# EAGLE design RF Power Meter (EAGLE 7.7.0)
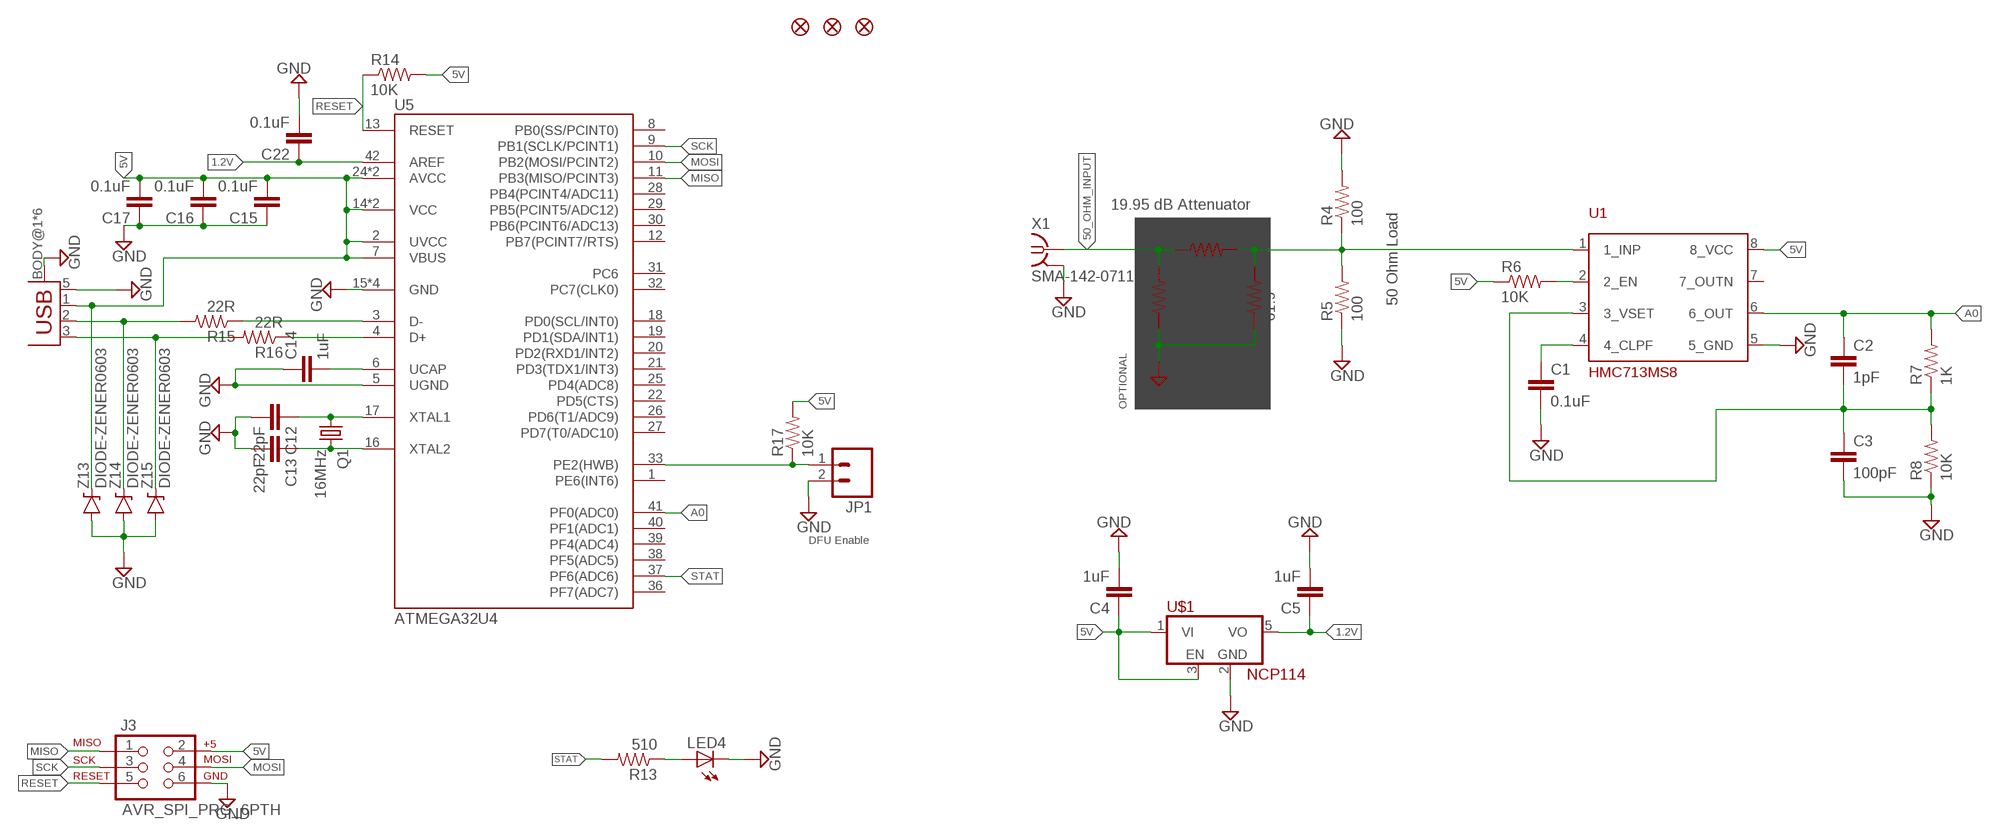
[diagram p0: schematic, sheet 1]

## Parts
C1  0.1uF  CAP0603-CAP  [0603-CAP]
C2  1pF  CAP0603-CAP  [0603-CAP]
C3  100pF  CAP0603-CAP  [0603-CAP]
C4  1uF  CAP0603-CAP  [0603-CAP]
C5  1uF  CAP0603-CAP  [0603-CAP]
C12  22pF  CAP0603-CAP  [0603-CAP]
C13  22pF  CAP0603-CAP  [0603-CAP]
C14  1uF  CAP0603-CAP  [0603-CAP]
C15  0.1uF  CAP0603-CAP  [0603-CAP]
C16  0.1uF  CAP0603-CAP  [0603-CAP]
C17  0.1uF  CAP0603-CAP  [0603-CAP]
C22  0.1uF  CAP0603-CAP  [0603-CAP]
J3  AVR_SPI_PRG_6PTH  [2X3]
JP1  M02PTH3  [1X02_LONGPADS]
JP2  FIDUCIAL1X2  [FIDUCIAL-1X2]
JP3  FIDUCIAL1X2  [FIDUCIAL-1X2]
JP4  FIDUCIAL1X2  [FIDUCIAL-1X2]
LED4  LED0603  [LED-0603]
Q1  16MHz  CRYSTAL3.2X2.5  [CRYSTAL_3.2X2.5]
R1  61.9  RESISTOR1206  [1206]
R2  249  RESISTOR1206  [1206]
R3  61.9  RESISTOR1206  [1206]
R4  100  RESISTOR1206  [1206]
R5  100  RESISTOR1206  [1206]
R6  10K  RESISTOR0603-RES  [0603-RES]
R7  1K  RESISTOR0603-RES  [0603-RES]
R8  10K  RESISTOR0603-RES  [0603-RES]
R13  510  RESISTOR0603-RES  [0603-RES]
R14  10K  RESISTOR0603-RES  [0603-RES]
R15  22R  RESISTOR0603-RES  [0603-RES]
R16  22R  RESISTOR0603-RES  [0603-RES]
R17  10K  RESISTOR0603-RES  [0603-RES]
U1  HMC713MS8  [MSOP-8]
U5  ATMEGA32U4  [TQFP-44]
U$1  NCP114  [SOT-23-5]
X1  SMA-142-0711-821/826  [J502-ND-142-0711-821/826]
X3  USB-MICROB  [USB-MICROB-10118192]
Z13  DIODE-ZENER0603  [0603-DIODE]
Z14  DIODE-ZENER0603  [0603-DIODE]
Z15  DIODE-ZENER0603  [0603-DIODE]

## Nets
1.2V: C5.1 C22.1 U5.42(AREF) U$1.5(VO)
5V: C4.1 C15.2 C16.2 C17.2 J3.2 R6.1 R14.2 R17.2 U1.8(8_VCC) U5.2(UVCC) U5.7(VBUS) U5.14(VCC) U5.24(AVCC) U5.34(VCC) U5.44(AVCC) U$1.1(VI) U$1.3(EN) X3.1(VBUS) Z13.C
50_OHM_INPUT: R1.2 R2.1 X1.1
A0: C2.1 R7.2 U1.6(6_OUT) U5.41(PF0(ADC0))
GND: C1.2 C3.2 C4.2 C5.2 C12.2 C13.2 C14.1 C15.1 C16.1 C17.1 C22.2 J3.6 JP1.2 LED4.C R1.1 R3.1 R4.2 R5.1 R8.1 U1.5(5_GND) U5.5(UGND) U5.15(GND) U5.23(GND) U5.35(GND) U5.43(GND) U$1.2(GND) X1.G@1 X1.G@2 X1.G@3 X1.G@4 X3.5(GND) X3.BODY@1(BODY) X3.BODY@2(BODY) X3.BODY@3(BODY) X3.BODY@4(BODY) X3.BODY@5(BODY) X3.BODY@6(BODY) Z13.A Z14.A Z15.A
MISO: J3.1 U5.11(PB3(MISO/PCINT3))
MOSI: J3.4 U5.10(PB2(MOSI/PCINT2))
N$4: R2.2 R3.2 R4.1 R5.2 U1.1(1_INP)
N$19: R6.2 U1.2(2_EN)
N$20: C1.1 U1.4(4_CLPF)
N$22: C2.2 C3.1 R7.1 R8.2 U1.3(3_VSET)
N$106: LED4.A R13.1
N$111: C12.1 Q1.P$1 U5.17(XTAL1)
N$113: C13.1 Q1.P$3 U5.16(XTAL2)
N$115: R15.2 X3.2(D-) Z14.C
N$116: C14.2 U5.6(UCAP)
N$117: R16.2 X3.3(D+) Z15.C
N$118: R16.1 U5.4(D+)
N$119: R15.1 U5.3(D-)
N$120: JP1.1 R17.1 U5.33(PE2(HWB))
RESET: J3.5 R14.1 U5.13(RESET)
SCK: J3.3 U5.9(PB1(SCLK/PCINT1))
STAT: R13.2 U5.37(PF6(ADC6))
Unconnected: U1.7(7_OUTN) U5.1(PE6(INT6)) U5.8(PB0(SS/PCINT0)) U5.12(PB7(PCINT7/RTS)) U5.18(PD0(SCL/INT0)) U5.19(PD1(SDA/INT1)) U5.20(PD2(RXD1/INT2)) U5.21(PD3(TDX1/INT3)) U5.22(PD5(CTS)) U5.25(PD4(ADC8)) U5.26(PD6(T1/ADC9)) U5.27(PD7(T0/ADC10)) U5.28(PB4(PCINT4/ADC11)) U5.29(PB5(PCINT5/ADC12)) U5.30(PB6(PCINT6/ADC13)) U5.31(PC6) U5.32(PC7(CLK0)) U5.36(PF7(ADC7)) U5.38(PF5(ADC5)) U5.39(PF4(ADC4)) U5.40(PF1(ADC1))

## Notes on the sheet
- 19.95 dB Attenuator
- 50 Ohm Load
- OPTIONAL
- DFU Enable

## Library data of the parts
C1-C5 C12-C17 C22 = SparkFun:CAP: Capacitor Standard 0603 ceramic capacitor, and 0.1" leaded capacitor.
J3 = SparkFun:AVR_SPI_PRG_6: AVR ISP 6 Pin This is the reduced ISP connector for AVR programming. Common on Arduino. This footprint will take up less PCB space and can be used with a 10-pin to 6-pin adapter such as SKU: BOB-08508
JP1 = SparkFun:M02: Header 2 Standard 2-pin 0.1" header. Use with straight break away headers (SKU : PRT-00116), right angle break away headers (PRT-00553), swiss pins (PRT-00743), machine pins (PRT-00117), and female headers (PRT-00115). Molex polarized connector foot print use with SKU : PRT-08233 with associated crimp pins and housings.
JP2-JP4 = SparkFun:FIDUCIAL: Fiducial Alignment Points Various fiducial points for machine vision alignment.
LED4 = SparkFun:LED: LEDs Standard schematic elements and footprints for 5mm, 3mm, 1206, and 0603 sized LEDs. 5mm - Spark Fun Electronics SKU : COM-00529 (and others)
Q1 = Nigel:CRYSTAL
R1-R8 R13-R17 = SparkFun:RESISTOR: Resistor Basic schematic elements and footprints for 0603, 1206, and PTH resistors.
U1 = Nigel:HMC713MS8: 54dB Logarithmic RF Detector 45 - 2700MHz
U5 = Nigel:ATMEGA32U4
U$1 = Nigel:NCP114: NCP114 300mA Low Dropout Linear Regulator
X1 = con-coax:SMA-: SMA 50 Ohm End Launch Jack Receptacle - Round Contact Johnson Components Source: www.johnsoncomponents.com .. J502-ND.pdf; MF: JOHNSON COMPONENTS; MPN: 142-0711-821; OC_FARNELL: 1019328; OC_NEWARK: 16F3627
X3 = Nigel:USB: USB Micro B Connector Ampehnol Part 10118192-0001LF
Z13-Z15 = Nigel:DIODE-ZENER

## Board
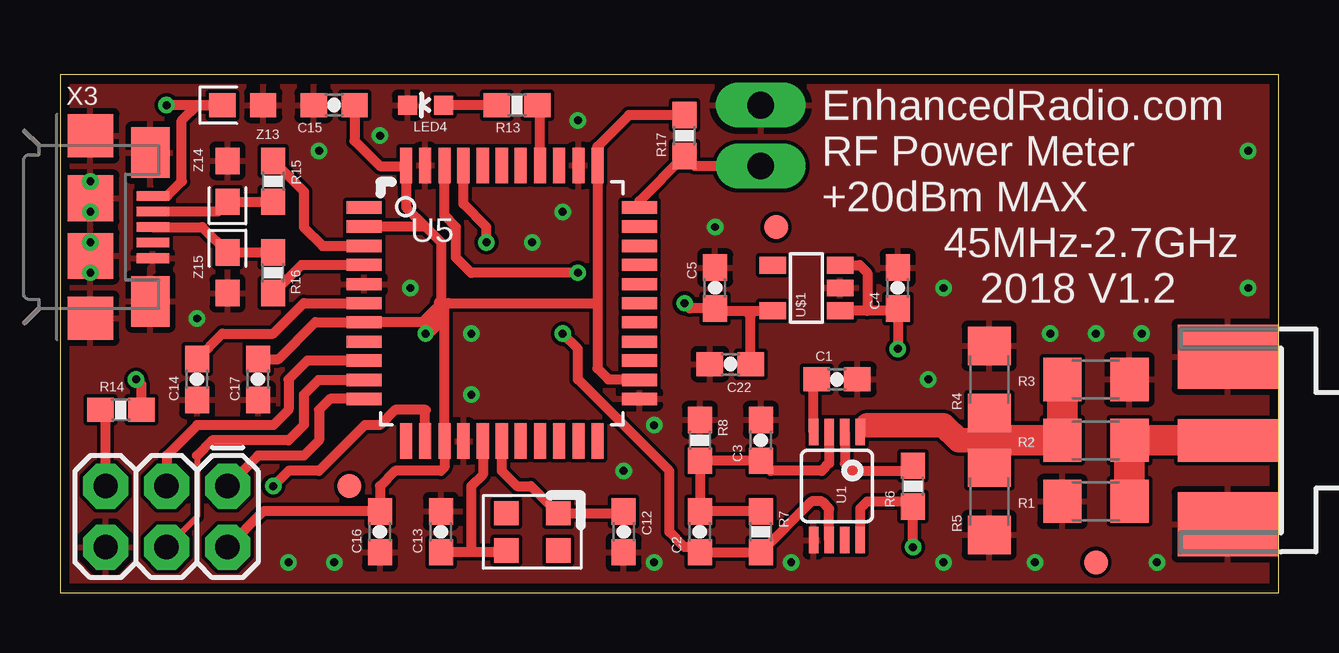
[diagram p1: board, top side]
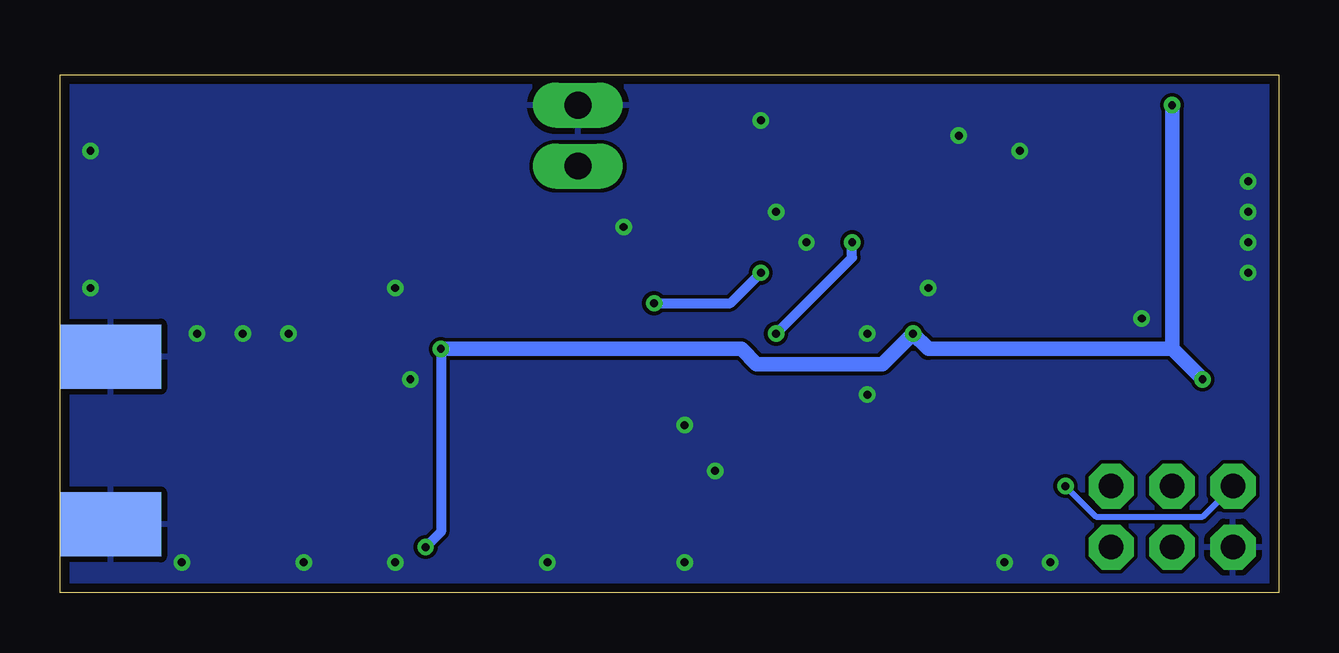
[diagram p2: board, bottom side, seen from below]

Size 50.8 x 21.59 mm. Coordinates in mm from the lower left corner, seen from the top.
Outline: 0,0 50.8,0 50.8,21.59 0,21.59 0,0
Copper layers (1*16): Top 0.0356mm / dielectric 1.5011mm / Bottom 0.0356mm
Design rules "LaenPCBOrderDRU": minimum track width 6mil, minimum drill 13mil, track to track 6mil, track to pad 6mil, pad to pad 6mil, via to via 6mil, smd to smd 6mil, copper to edge 15mil, drill to drill 6mil, minimum pad ring 7mil, minimum via ring 7mil, stop-mask expansion 4mil, vias tented up to drill 0mil, thermal gap 10mil

### Footprints (pad centres in the part's own frame; a part is rotated, then mirrored left to right if it is on the bottom)
0603-CAP = smd 1.1 x 1: 1 -0.85,0; 2 0.85,0
2X3 = drill 1.016 pad 1.88 octagon: 1 0,0; 2 0,2.54; 3 2.54,0; 4 2.54,2.54; 5 5.08,0; 6 5.08,2.54
1X02_LONGPADS = drill 1.118 pad 1.88 long: 1 0,0; 2 2.54,0
FIDUCIAL-1X2 = smd 1 x 1: 1 0,0
LED-0603 = smd 0.8 x 0.8: A 0,-0.75; C 0,0.75
CRYSTAL_3.2X2.5 = smd 1.016 x 1.016: P$1 -1.079,-0.775; P$2 1.079,-0.775; P$3 1.079,0.775; P$4 -1.079,0.775
1206 = smd 1.6 x 1.8: 1 -1.4,0; 2 1.4,0
0603-RES = smd 1.1 x 1: 1 -0.85,0; 2 0.85,0
MSOP-8 = smd 0.4 x 1.1: 1 -0.975,-2.25; 2 -0.325,-2.25; 3 0.325,-2.25; 4 0.975,-2.25; 5 0.975,2.25; 6 0.325,2.25; 7 -0.325,2.25; 8 -0.975,2.25
TQFP-44 = smd 1.473 x 0.508: 1 -5.74,3.988; 2 -5.74,3.2; 3 -5.74,2.388; 4 -5.74,1.6; 5 -5.74,0.787; 6 -5.74,0; 7 -5.74,-0.787; 8 -5.74,-1.6; 9 -5.74,-2.388; 10 -5.74,-3.2; 11 -5.74,-3.988; 23 5.74,-3.988; 24 5.74,-3.2; 25 5.74,-2.388; 26 5.74,-1.6; 27 5.74,-0.787; 28 5.74,0; 29 5.74,0.787; 30 5.74,1.6; 31 5.74,2.388; 32 5.74,3.2; 33 5.74,3.988 | smd 0.508 x 1.473: 12 -3.988,-5.74; 13 -3.2,-5.74; 14 -2.388,-5.74; 15 -1.6,-5.74; 16 -0.787,-5.74; 17 0,-5.74; 18 0.787,-5.74; 19 1.6,-5.74; 20 2.388,-5.74; 21 3.2,-5.74; 22 3.988,-5.74; 34 3.988,5.74; 35 3.2,5.74; 36 2.388,5.74; 37 1.6,5.74; 38 0.787,5.74; 39 0,5.74; 40 -0.787,5.74; 41 -1.6,5.74; 42 -2.388,5.74; 43 -3.2,5.74; 44 -3.988,5.74
SOT-23-5 = smd 0.7 x 1.1: 1 -0.95,-1.4; 2 0,-1.4; 3 0.95,-1.4; 4 0.95,1.4; 5 -0.95,1.4
J502-ND-142-0711-821/826 = smd 4.191 x 1.778: 1 2.115,0 | smd 4.191 x 2.667: G@1 2.115,3.495; G@2 2.115,-3.495 | smd 4.191 x 2.667 bottom: G@3 2.115,3.495; G@4 2.115,-3.495
USB-MICROB-10118192 = smd 0.4 x 1.35: 1 -1.3,2.6; 2 -0.65,2.6; 3 0,2.6; 4 0.65,2.6; 5 1.3,2.6 | smd 1.8 x 1.9: BODY@1 -3.8,0; BODY@4 3.8,0 | smd 1.9 x 1.9: BODY@2 -1.2,0; BODY@3 1.2,0 | smd 2.1 x 1.6: BODY@5 -3.1,2.5; BODY@6 3.1,2.5
0603-DIODE = smd 1.1 x 1: A -0.85,0; C 0.85,0

### Placement (x,y rotation side)
C1  32.38,8.89 0 top
C2  26.67,2.54 90 top
C3  29.21,6.35 90 top
C4  34.92,12.7 90 top
C5  27.3,12.7 90 top
C12  23.5,2.54 270 top
C13  15.88,2.54 90 top
C14  5.71,8.89 90 top
C15  11.43,20.32 0 top
C16  13.34,2.54 90 top
C17  8.26,8.89 90 top
C22  27.94,9.53 180 top
J3  6.99,4.45 180 top
JP1  29.21,17.78 90 top
JP2  29.84,15.24 0 top
JP3  43.18,1.27 0 top
JP4  12.06,4.45 0 top
LED4  15.24,20.32 90 top
Q1  19.68,2.54 180 top
R1  43.18,3.81 0 top
R2  43.18,6.35 180 top
R3  43.18,8.89 180 top
R4  38.73,8.89 90 top
R5  38.73,3.81 90 top
R6  35.56,4.45 90 top
R7  29.21,2.54 270 top
R8  26.67,6.35 270 top
R13  19.05,20.32 0 top
R14  2.54,7.62 0 top
R15  8.89,17.14 270 top
R16  8.89,13.34 90 top
R17  26.04,19.05 90 top
U1  32.38,4.45 180 top
U5  18.41,12.06 0 top
U$1  31.11,12.7 90 top
X1  50.8,6.35 180 top
X3  1.27,15.24 270 top
Z13  7.62,20.32 180 top
Z14  6.99,17.14 270 top
Z15  6.99,13.34 90 top

### Tracks (layer width: path | path; a pad name or v marks a point on that pad's centre or on a via)
1.2V  (via drill 0.33)
  Top 0.406: 28.57,11.75 27.41,11.75 C5.1 26.25,11.85 v26.04,12.06 | 28.57,11.75 U$1.5 | C22.1 28.79,11.54 28.57,11.75 | v21.59,13.34 17.14,13.34 16.51,13.97 16.51,15.24 16.03,15.72 U5.42
  Bottom 0.406: v26.04,12.06 22.86,12.06 v21.59,13.34
5V  (via drill 0.33)
  Top 0.406: C4.1 34.83,11.75 | 34.83,11.75 33.66,11.75 | 33.66,11.75 U$1.1 | U$1.3 33.34,13.65 33.66,13.34 33.66,11.75 | U1.8 33.36,3.52 33.66,3.81 35.34,3.81 R6.1 v35.56,1.91 | U5.2 15.21,15.27 | 15.21,15.27 15.88,14.61 15.88,12.06 | 15.88,12.06 15.09,11.28 U5.7 10.64,11.28 9.11,9.74 C17.2 | 15.21,15.27 14.43,16.05 U5.44 14.4,17.78 13.34,17.78 12.28,18.84 C15.2 | 16.03,11.91 U5.14 16.03,5.23 15.88,5.08 13.97,5.08 13.34,4.45 C16.2 8.47,3.39 J3.2 | 16.03,11.91 15.88,12.06 | X3.1 4.47,16.54 5.08,17.14 5.08,19.68 5.71,20.32 Z13.C v4.45,20.32 | 22.4,12.06 U5.34 22.4,18.59 23.71,19.9 R17.2 | 22.4,12.06 22.4,9.35 22.86,8.89 24.13,8.89 U5.24 | 16.03,11.91 16.18,12.06 22.4,12.06 | v3.17,8.89 3.39,8.68 R14.2 | 34.83,11.75 34.92,11.65 v34.92,10.16
  Top 0.61: v15.24,10.79 15.88,11.43 15.88,12.06
  Bottom 0.406: v34.92,10.16 34.92,2.54 v35.56,1.91
  Bottom 0.61: v4.45,20.32 4.45,10.16 | 4.45,10.16 v3.17,8.89 | 4.45,10.16 14.61,10.16 v15.24,10.79 16.51,9.53 21.77,9.53 22.4,10.16 v34.92,10.16
50_OHM_INPUT
  Top 1.27: X1.1 R2.1 R1.2
A0  (via drill 0.33)
  Top 0.406: U1.6 32.06,3.5 31.75,3.81 31.33,3.81 R7.2 C2.1 26.45,1.91 26.04,1.91 25.4,2.54 25.4,5.08 21.59,8.89 21.59,10.16 v20.95,10.79 | v17.78,14.61 17.78,15.24 16.82,16.2 U5.41
  Bottom 0.406: v20.95,10.79 17.78,13.97 v17.78,14.61
GND  (via drill 0.33)
  other vias: 14.61,12.7 10.79,18.41 13.34,19.05 11.43,1.27 9.53,1.27 23.5,5.08 45.72,1.27 40.64,1.27 36.83,1.27 30.48,1.27 24.77,1.27 17.14,8.26 17.14,10.79 20.95,15.88 19.68,14.61 21.59,19.68 5.71,11.43 1.27,17.14 1.27,15.88 1.27,14.61 1.27,13.34 24.77,6.99 36.2,8.89 45.09,10.79 43.18,10.79 41.27,10.79 49.53,18.41 49.53,12.7 36.83,12.7 27.3,15.24
  pour Bottom: 0,21.59 50.8,21.59 50.8,0 0,0
  pour Top: 0,21.59 50.8,21.59 50.8,0 0,0
MISO
  Top 0.406: U5.11 11.25,8.08 10.79,7.62 10.79,6.35 10.16,5.71 8.26,5.71 J3.1
MOSI
  Top 0.254: 5.71,5.71 5.71,3.17 J3.4
  Top 0.406: U5.10 10.77,8.87 10.16,8.26 10.16,6.99 9.53,6.35 6.35,6.35 5.71,5.71
N$4
  Top 0.406: U1.1 33.66,6.99
  Top 1.016: 33.66,6.99 36.83,6.99 37.47,6.35 38.73,6.35
  Top 1.27: R3.2 R2.2 38.73,6.35 | 38.73,6.35 R5.2 | R4.1 38.73,6.35
N$19
  Top 0.406: U1.2 32.71,5.39 33.02,5.08 35.34,5.08 R6.2
N$20
  Top 0.406: U1.4 31.41,8.77 C1.1
N$22
  Top 0.406: R7.1 C2.2 R8.2 C3.1 29.63,5.08 31.75,5.08 32.06,5.39 U1.3
N$106
  Top 0.406: R13.1 LED4.A
N$111
  Top 0.406: U5.17 18.41,5.08 19.05,4.45 19.63,4.45 Q1.P$1 23.42,3.31 C12.1
N$113
  Top 0.406: Q1.P$3 18.53,1.69 17.14,1.69 | 17.14,1.69 C13.1 | U5.16 17.63,4.93 17.14,4.45 17.14,1.69
N$115
  Top 0.406: X3.2 6.58,15.89 Z14.C R15.2
N$116
  Top 0.406: C14.2 6.77,10.79 8.89,10.79 10.16,12.06 U5.6
N$117
  Top 0.406: X3.3 5.93,15.24 Z15.C R16.2
N$118
  Top 0.406: R16.1 10.07,13.66 U5.4
N$119
  Top 0.406: R15.1 10.16,16.73 10.16,15.24 10.95,14.45 U5.3
N$120
  Top 0.406: U5.33 24.16,16.32 R17.1 26.45,17.78 JP1.1
RESET  (via drill 0.33)
  Top 0.406: J3.5 1.91,7.41 R14.1 | U5.13 15.21,7.59 15.24,7.62 13.97,7.62 13.34,6.99 12.7,6.99 10.79,5.08 9.53,5.08 v8.89,4.45
  Bottom 0.254: v8.89,4.45 7.62,3.17 3.17,3.17 J3.5
SCK
  Top 0.406: U5.9 10.31,9.68 9.53,8.89 9.53,7.62 8.89,6.99 5.71,6.99 4.45,5.71 J3.3
STAT
  Top 0.406: U5.37 20.02,20.2 R13.2

### Text on the board
tPlace: EnhancedRadio.com | RF Power Meter | +20dBm MAX | 45MHz-2.7GHz | 2018 V1.2